# Altium schematic sheet Power.SchDoc
size A4
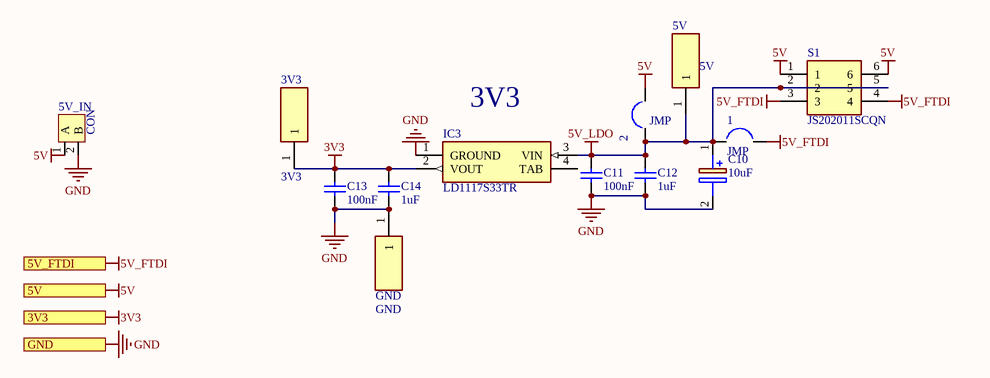
[diagram p0: Power.SchDoc]

## Parts
1  JMP  [Jumper]
2  JMP  [Jumper]
3V3  3V3  [1508000150000030]
5V  5V  [1508000150000030]
5V_IN  CON  [TBG-5.0]
C10  10uF  [CAPPM3216X180N]
C11  100nF  [1608[0603]]
C12  1uF  [1608[0603]]
C13  100nF  [1608[0603]]
C14  1uF  [1608[0603]]
GND  GND  [1508000150000030]
IC3  LD1117S33TR  [SOT230P700X180-4N]
S1  JS202011SCQN  [JS202011SCQN]

## Ports
3V3 (out), 5V (out), 5V_FTDI (in), GND

## Nets
3V3: 3V3.1 C13.1 C14.1 IC3.2(VOUT) ; port 3V3
5V: 2.2 5V_IN.1(A) S1.1 S1.6 ; port 5V
5V_FTDI: 1.2 S1.3 S1.4 ; port 5V_FTDI
5V_LDO: 1.1 2.1 5V.1 C10.1(+) C11.1 C12.1 IC3.3(VIN) S1.2 S1.5
GND: 5V_IN.2(B) C10.2(-) C11.2 C12.2 C13.2 C14.2 GND.1 IC3.1(GROUND) ; port GND

Not connected (* = marked no-connect by the designer): IC3 4(TAB)

## Notes on the sheet
- (near IC3) 3V3

## Library data of the parts
3V3 5V GND = 5015: Undefined or Miscellaneous; Manufacturer_Name: Keystone Electronics; Allied_Number: 70182998; Datasheet Link: http://www.keyelco.com/product-pdf.cfm?p=1353; Height: 1.52mm; Manufacturer_Part_Number: 5015; Mouser Part Number: 534-5015; Mouser Price/Stock: https://www.mouser.com/Search/Refine.aspx?Keyword=534-5015; Allied Price/Stock: https://www.alliedelec.com/keystone-electronics-5015/70182998/
C10 = TAJA106K004RNJ: Capacitor Polarised; Manufacturer_Name: AVX; Datasheet Link: http://www.farnell.com/datasheets/1680476.pdf; Height: 1.8mm; Manufacturer_Part_Number: TAJA106K004RNJ; Mouser Part Number: 581-TAJA106K004R; Mouser Price/Stock: https://www.mouser.com/Search/Refine.aspx?Keyword=581-TAJA106K004R
C11 = Cap Semi: Capacitor; Value: 100pF; Published: 8-Jun-2000; LatestRevisionDate: 29-May-2009; LatestRevisionNote: IPC-7351 Footprint Added.; PackageReference: C1206; Publisher: Altium Limited; PackageDescription: Chip Capacitor
C12-C14 = Cap Semi: Capacitor; Published: 8-Jun-2000; LatestRevisionDate: 29-May-2009; LatestRevisionNote: IPC-7351 Footprint Added.; PackageReference: C1206; Publisher: Altium Limited; PackageDescription: Chip Capacitor
  C12 C14: Value: 1uF
  C13: Value: 100nF
IC3 = LD1117S33TR: Integrated Circuit; Manufacturer_Name: STMicroelectronics; Allied_Number: 70390201; Datasheet Link: http://www.st.com/st-web-ui/static/active/en/resource/technical/document/datasheet/CD00000544.pdf; Height: 1.8mm; Manufacturer_Part_Number: LD1117S33TR; Mouser Part Number: 511-LD1117S33; Mouser Price/Stock: https://www.mouser.com/Search/Refine.aspx?Keyword=511-LD1117S33; RS Part Number: 7140697P; RS Price/Stock: http://uk.rs-online.com/web/p/products/7140697P; Allied Price/Stock: http://www.alliedelec.com/stmicroelectronics-ld1117s33tr/70390201/
S1 = JS202011SCQN: Switch; Manufacturer_Name: C & K COMPONENTS; Datasheet Link: http://www.ckswitches.com/media/1422/js.pdf; Height: 5.5mm; Manufacturer_Part_Number: JS202011SCQN; Mouser Part Number: 611-JS202011SCQN; Mouser Price/Stock: https://www.mouser.co.uk/ProductDetail/CK/JS202011SCQN?qs=LgMIjt8LuD95JYWxZ7NvZA%3D%3D; Arrow Part Number: JS202011SCQN; Arrow Price/Stock: https://www.arrow.com/en/products/js202011scqn/ck